# Altium project vsd_schools_version_finalPrjPcb.PrjPcb
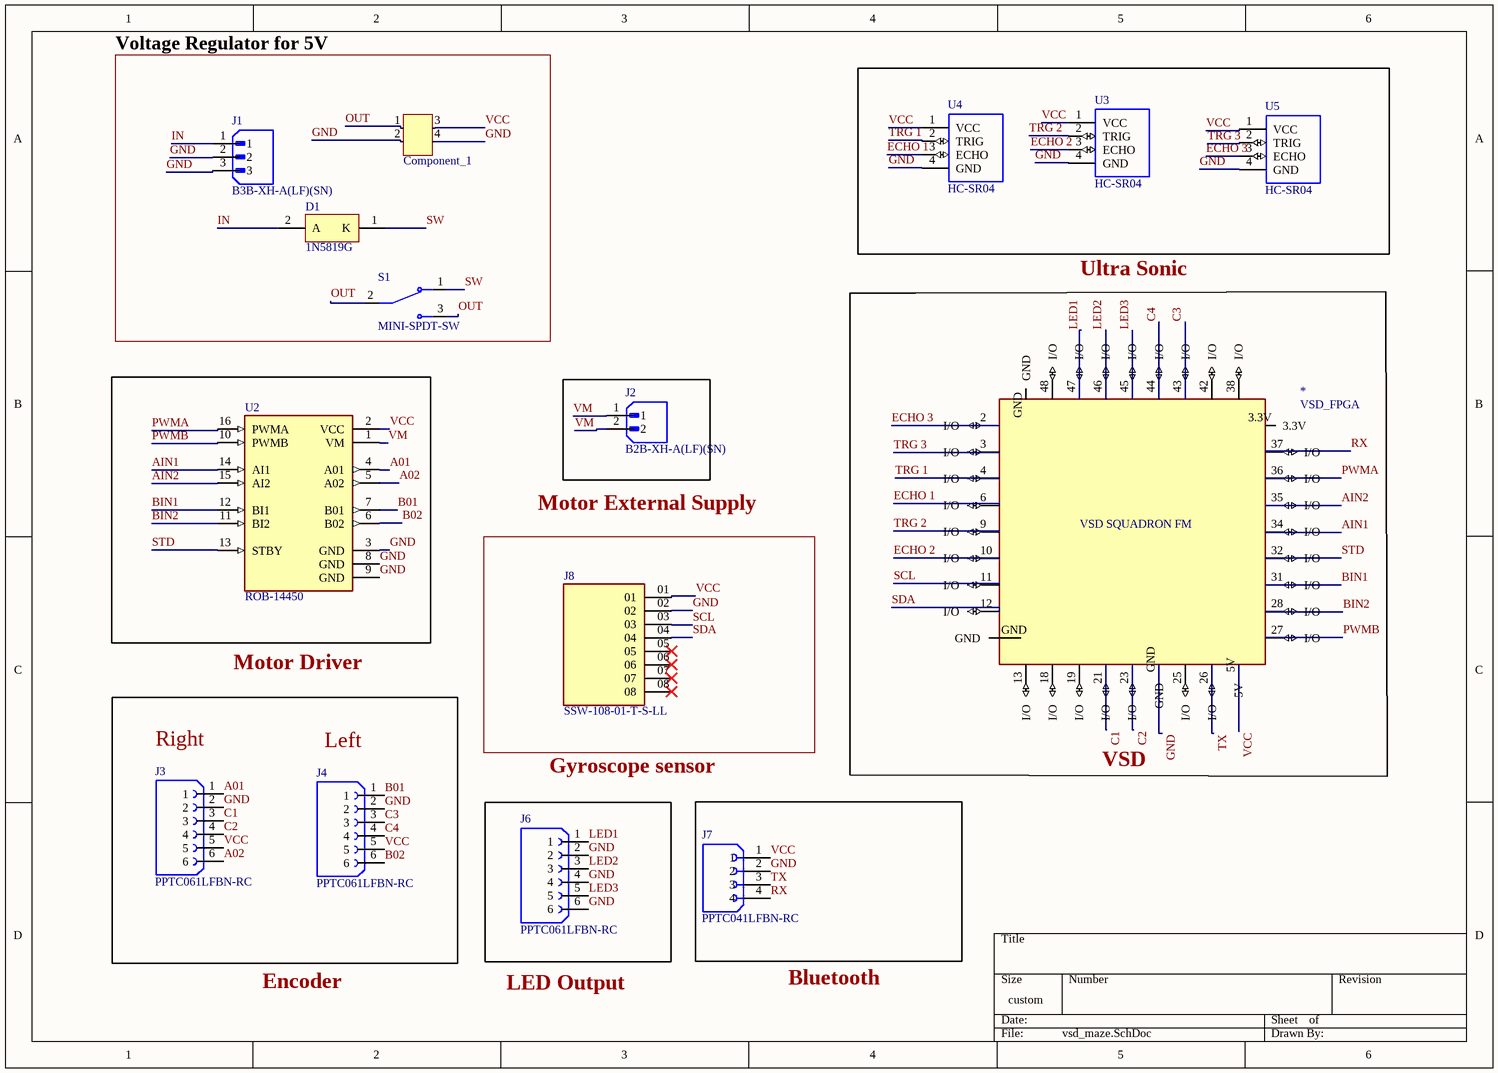
[diagram p0: vsd_maze.SchDoc]
1 sheet, 15 parts. Net scope: global (net labels, ports and power ports of the same name join across sheets).
Board file: vsd_maze.PcbDoc

## Sheet vsd_maze.SchDoc
size 279 x 199 mm; SheetNumber: 1; SheetTotal: 1

### Parts
*  VSD_FPGA  [VSD_FPGA2]
?  Component_1  [PCBComponent_1]
D1  1N5819G  [ONSC-AXIAL_LEAD-2-59-10_P]
J1  B3B-XH-A(LF)(SN)  [JST_B3B-XH-A(LF)(SN)]
J2  B2B-XH-A(LF)(SN)  [JST_B2B-XH-A(LF)(SN)]
J3  PPTC061LFBN-RC  [SULLINS_PPTC061LFBN-RC]
J4  PPTC061LFBN-RC  [SULLINS_PPTC061LFBN-RC]
J6  PPTC061LFBN-RC  [SULLINS_PPTC061LFBN-RC]
J7  PPTC041LFBN-RC  [SULLINS_PPTC041LFBN-RC]
J8  SSW-108-01-T-S-LL  [SAMTEC_SSW-108-01-T-S-LL]
S1  MINI-SPDT-SW  [SW_MINI-SPDT-SW]
U2  ROB-14450  [MODULE_ROB-14450]
U3  HC-SR04  [XCVR_HC-SR04]
U4  HC-SR04  [XCVR_HC-SR04]
U5  HC-SR04  [XCVR_HC-SR04]

### Blocks framed on the sheet
Voltage Regulator for 5V: ? D1 J1 S1

### Nets
A01: J3.1 U2.4(A01)
A02: J3.6 U2.5(A02)
AIN1: *.34(I/O) U2.14(AI1)
AIN2: *.35(I/O) U2.15(AI2)
B01: J4.1 U2.7(B01)
B02: J4.6 U2.6(B02)
BIN1: *.31(I/O) U2.12(BI1)
BIN2: *.28(I/O) U2.11(BI2)
C1: *.21(I/O) J3.3
C2: *.23(I/O) J3.4
C3: *.43(I/O) J4.3
C4: *.44(I/O) J4.4
ECHO 1: *.6(I/O) U4.3(ECHO)
ECHO 2: *.10(I/O) U3.3(ECHO)
ECHO 3: *.2(I/O) U5.3(ECHO)
GND: *.GND ?.2 ?.4 J1.2 J1.3 J3.2 J4.2 J6.2 J6.4 J6.6 J7.2 J8.02 U2.3(GND) U2.8(GND) U2.9(GND) U4.4(GND) U5.4(GND)
IN: D1.2(A) J1.1
LED1: *.47(I/O) J6.1
LED2: *.46(I/O) J6.3
LED3: *.45(I/O) J6.5
OUT: ?.1 S1.2 S1.3
PWMA: *.36(I/O) U2.16(PWMA)
PWMB: *.27(I/O) U2.10(PWMB)
RX: *.37(I/O) J7.4
SCL: *.11(I/O) J8.03
SDA: *.12(I/O) J8.04
STD: *.32(I/O) U2.13(STBY)
SW: D1.1(K) S1.1
TRG 1: *.4(I/O) U4.2(TRIG)
TRG 2: *.9(I/O) U3.2(TRIG)
TRG 3: *.3(I/O) U5.2(TRIG)
TX: *.26(I/O) J7.3
VCC: *.5V ?.3 J3.5 J4.5 J7.1 J8.01 U2.2(VCC) U3.1(VCC) U4.1(VCC) U5.1(VCC)
VM: J2.1 J2.2 U2.1(VM)

Not connected (* = marked no-connect by the designer): * 3.3V 13(I/O) 18(I/O) 19(I/O) 25(I/O) 38(I/O) 42(I/O) 48(I/O); J8 05* 06* 07* 08*; U3 4(GND)

### Notes on the sheet
- Ultra Sonic
- Motor External Supply
- Motor Driver
- (near J3) Right
- (near J4) Left
- Gyroscope sensor
- (near *) VSD
- Encoder
- LED Output
- Bluetooth
- Labels drawn without touching a wire or pin: TRG 2
- (in symbol VSD_FPGA) VSD SQUADRON FM

### Library data of the parts
* = VSD_FPGA: VSD SQUADROM FM FPGA
D1 = CMP-1055-00041-1: Rectifier, 2-Pin Axial_Lead, Pb-Free, Bulk Bag; Manufacturer: On Semiconductor; IFSM Max (A): 25; Configuration: Single; PackageDescription: 2-Pin, Axial Lead, Diameter 2.35 mm; ComponentLink2URL: http://www.onsemi.cn/pub_link/Collateral/1N5817-D.PDF; ComponentLink1Description: Manufacturer URL; Mounting Technology: Through Hole; RoHS: TRUE; ComponentLink2Description: Datasheet; ComponentLink1URL: http://www.onsemi.com/; PartNumber: 1N5819G; DatasheetVersion: Rev. 10; Packing: Bulk Bag; PackageVersion: Rev. U, 02/2005; PackageReference: AXIAL_LEAD-2-59-10; ComponentLink3URL: http://www.onsemi.cn/pub_link/Collateral/59-10.PDF; ComponentLink3Description: Package Specification
J1 = B3B-XH-A(LF)(SN): Connector Header Through Hole 3 position 0.098 (2.50mm); MF: JST Sales; SnapEDA_Link: https://www.snapeda.com/parts/B3B-XH-A(LF)(SN)/JST/view-part/?ref=snap; Package: None; Value: *; MP: B3B-XH-A(LF)(SN); Check_prices: https://www.snapeda.com/parts/B3B-XH-A(LF)(SN)/JST/view-part/?ref=eda
J2 = B2B-XH-A(LF)(SN): Connector Header Through Hole 2 position 0.098 (2.50mm); MF: JST Sales; SnapEDA_Link: https://www.snapeda.com/parts/B2B-XH-A(LF)(SN)/JST/view-part/?ref=snap; Package: None; Value: *; MP: B2B-XH-A(LF)(SN); Check_prices: https://www.snapeda.com/parts/B2B-XH-A(LF)(SN)/JST/view-part/?ref=eda
J3 J4 J6 = PPTC061LFBN-RC: 6 Position Total Single Row 2.54 mm Pitch Straight Female Header; MF: Sullins Connector Solutions; MP: PPTC061LFBNRC; SnapEDA_Link: https://www.snapeda.com/parts/PPTC061LFBNRC/Sullins/view-part/?ref=snap; Package: None; Value: *; Check_prices: https://www.snapeda.com/parts/PPTC061LFBNRC/Sullins/view-part/?ref=eda
J7 = PPTC041LFBN-RC: 4 Position Header Connector 0.100 (2.54mm) Through Hole Tin; MF: Sullins Connector; SnapEDA_Link: https://www.snapeda.com/parts/PPTC041LFBN-RC/Sullins/view-part/?ref=snap; Package: None; Value: *; MP: PPTC041LFBN-RC; Check_prices: https://www.snapeda.com/parts/PPTC041LFBN-RC/Sullins/view-part/?ref=eda
J8 = SSW-108-01-T-S-LL: MF: Samtec; MP: SSW-108-01-T-S-LL; Price: None; Availability: Unavailable; Value: *; Package: None
S1 = MINI-SPDT-SW: Simple breadboard friendly SPDT slide switch. Rated at 30V/200mA with operating force of 250 +/-100gf.; Availability: Unavailable; Package: None; MP: MINI-SPDT-SW; Value: *; Price: None
U2 = ROB-14450: TB6612FNG Motor Controller/Driver Power Management Evaluation Board; MF: SparkFun Electronics; Check_prices: https://www.snapeda.com/parts/ROB-14450/SparkFun%20Electronics/view-part/2656367/?ref=eda; Package: None; MP: ROB-14450; Value: *; Availability: In Stock; SnapEDA_Link: https://www.snapeda.com/parts/ROB-14450/SparkFun%20Electronics/view-part/2656367/?ref=snap; Price: None
U3-U5 = HC-SR04: Ultrasonic Sensor Module; Availability: Unavailable; MP: HC-SR04; Value: *; Price: None; Package: None